# Altium schematic sheet SDCARD.SchDoc
size A4; SheetNumber: 3; SheetTotal: 6
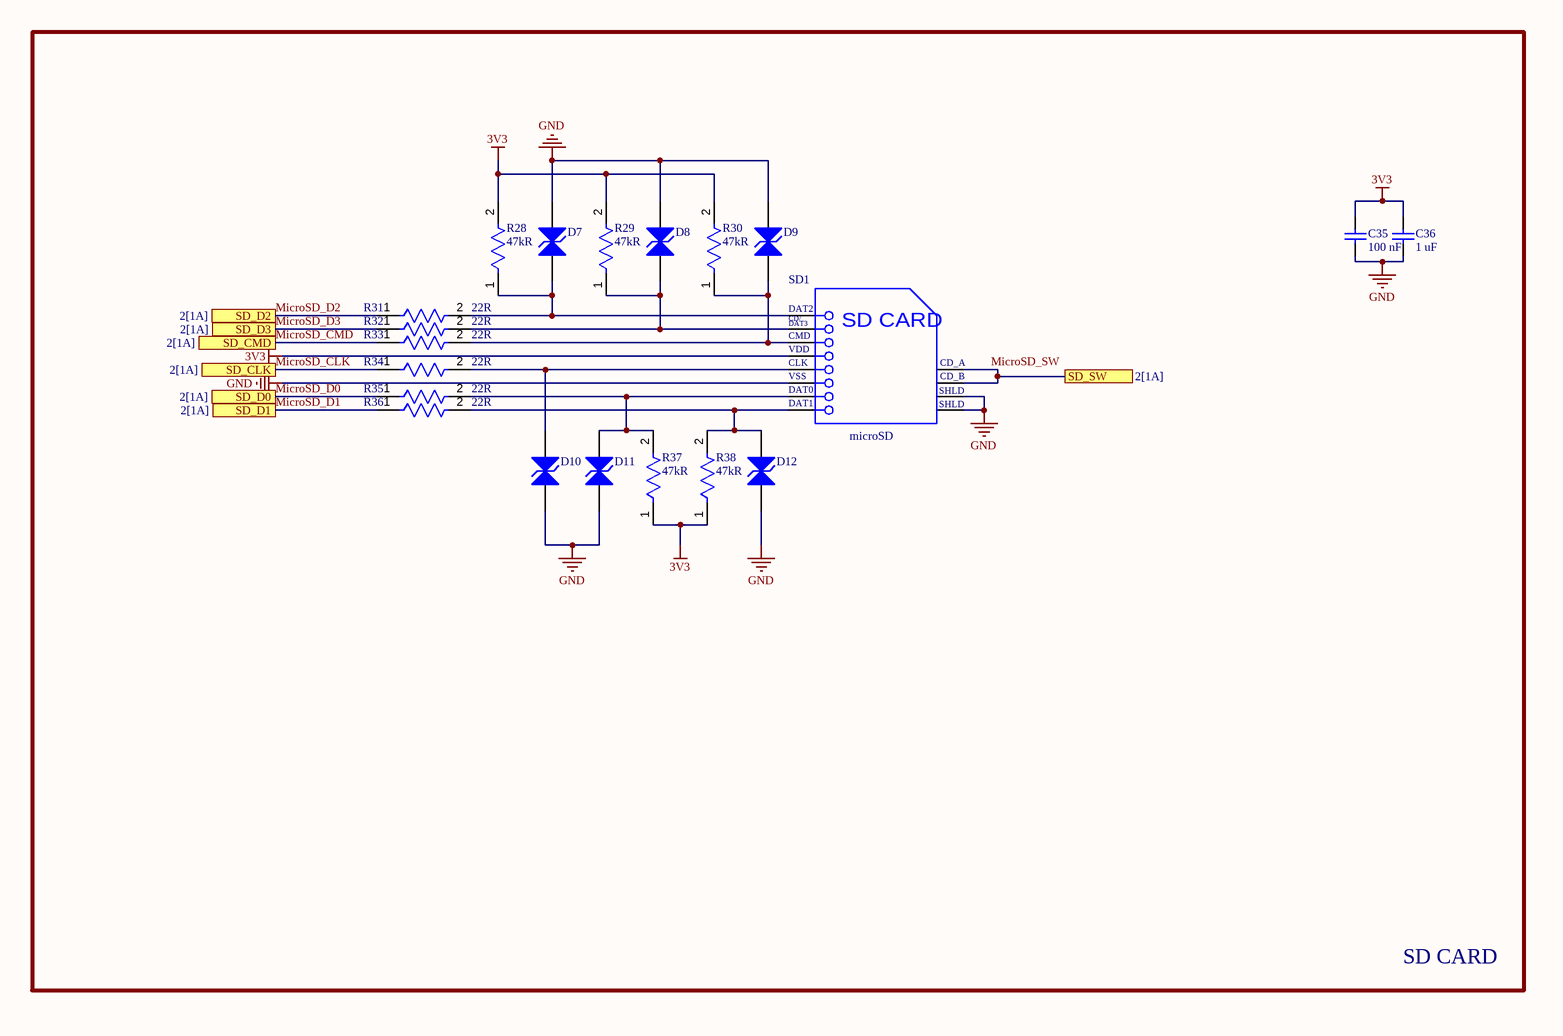
[diagram p0: SDCARD.SchDoc]

## Parts
C35  value 100 nF  [CAPC2013X145X50LL20T25]  (hidden comment: C0805C104K9RACTU)
C36  value 1 uF  [CAPC2013X135X45LL10T25]  (hidden comment: GRM21BR60J225KA01K)
D7  SMAJ5.0CA-E3/5A  [VISH-DO-214AC-2_N]  (value not drawn)
D8  SMAJ5.0CA-E3/5A  [VISH-DO-214AC-2_N]  (value not drawn)
D9  SMAJ5.0CA-E3/5A  [VISH-DO-214AC-2_N]  (value not drawn)
D10  SMAJ5.0CA-E3/5A  [VISH-DO-214AC-2_N]  (value not drawn)
D11  SMAJ5.0CA-E3/5A  [VISH-DO-214AC-2_N]  (value not drawn)
D12  SMAJ5.0CA-E3/5A  [VISH-DO-214AC-2_N]  (value not drawn)
R28  Resistance: 47kR  [FP-CRCW0805-e3-MFG]  (hidden comment: CRCW080547K0JNEA)
R29  Resistance: 47kR  [FP-CRCW0805-e3-MFG]  (hidden comment: CRCW080547K0JNEA)
R30  Resistance: 47kR  [FP-CRCW0805-e3-MFG]  (hidden comment: CRCW080547K0JNEA)
R31  Resistance: 22R  [FP-KTR10-IPC_C]  (hidden comment: KTR10EZPF22R0)
R32  Resistance: 22R  [FP-KTR10-IPC_C]  (hidden comment: KTR10EZPF22R0)
R33  Resistance: 22R  [FP-KTR10-IPC_C]  (hidden comment: KTR10EZPF22R0)
R34  Resistance: 22R  [FP-KTR10-IPC_C]  (hidden comment: KTR10EZPF22R0)
R35  Resistance: 22R  [FP-KTR10-IPC_C]  (hidden comment: KTR10EZPF22R0)
R36  Resistance: 22R  [FP-KTR10-IPC_C]  (hidden comment: KTR10EZPF22R0)
R37  Resistance: 47kR  [FP-CRCW0805-e3-MFG]  (hidden comment: CRCW080547K0JNEA)
R38  Resistance: 47kR  [FP-CRCW0805-e3-MFG]  (hidden comment: CRCW080547K0JNEA)
SD1  Card Type: microSD  [MOLX-104031-0811_V]  (hidden comment: 104031-0811)

## Ports
SD_CLK (see 2[1A]), SD_CMD (see 2[1A]), SD_D0 (see 2[1A]), SD_D1 (see 2[1A]), SD_D2 (see 2[1A]), SD_D3 (see 2[1A]), SD_SW (see 2[1A])

## Nets
3V3: C35.2 C36.2 R28.2 R29.2 R30.2 R37.1 R38.1 SD1.4(VDD)
GND: C35.1 C36.1 D7.1(A1) D8.1(A1) D9.1(A1) D10.2(A2) D11.2(A2) D12.2(A2) SD1.6(VSS2) SD1.11(SHLD1) SD1.12(SHLD2)
MicroSD_CLK: R34.1 ; port SD_CLK
MicroSD_CMD: R33.1 ; port SD_CMD
MicroSD_D0: R35.1 ; port SD_D0
MicroSD_D1: R36.1 ; port SD_D1
MicroSD_D2: R31.1 ; port SD_D2
MicroSD_D3: R32.1 ; port SD_D3
MicroSD_SW: SD1.9(CD_A) SD1.10(CD_B) ; port SD_SW
NetD7_2: D7.2(A2) R28.1 R31.2 SD1.1(CD/DAT3)
NetD8_2: D8.2(A2) R29.1 R32.2 SD1.2(CMD)
NetD9_2: D9.2(A2) R30.1 R33.2 SD1.3(VSS1)
NetD10_1: D10.1(A1) R34.2 SD1.5(CLK)
NetD11_1: D11.1(A1) R35.2 R37.2 SD1.7(DAT0)
NetD12_1: D12.1(A1) R36.2 R38.2 SD1.8(DAT1)

## Notes on the sheet
- SD CARD
- DWG. NO.
- REV.
- SHT.
- REVISION
- DESCRIPTION
- DATE
- APPROVED
- THIS DOCUMENT AND THE DATA DISCLOSED HEREIN OR HEREWITH IS THE PROPERTY OF ALTIUM LIMITED AND MAY BE FREELY DISTRIBUTED IN WHOLE. NO RIGHTS ARE RESERVED OR EXPRESS OR IMPLIED WARANTEE GIVEN.
- ENG:
- DSN:
- APPROVALS
- PROJECT
- DOCUMENT REVISION:
- DESIGN ITEM:
- CHK:
- BOM:
- REFERENCE DOCUMENTS
- PROJECT REVISION:
- TITLE
- FAB DWG:
- PCB DWG:
- ASSY DWG:
- SCALE:
- SIZE
- D
- CAGE CODE
- FILE NAME
- DWG NO.
- SHEET
- OF
- REV
- (in symbol CMP-2000-05825-1) DAT2; CD/; DAT3; SD CARD; VSS; SHLD

## Library data of the parts
C35 = CMP-1036-04391-2: Manufacturer: Kemet; Part Number: C0805C104K9RACTU
C36 = CMP-2007-03531-1: Manufacturer: Murata; Part Number: GRM21BR60J225KA01K
D7-D12 = CMP-0548-00276-2: Transient Voltage Suppressor, 6.40 to 231 V, 5 V Stand-off Voltage, Bi-Directional, -55 to 155 degC, 2-pin DO-214AC, Pb-Free, Tape and Reel; Manufacturer: Vishay Semiconductor; PPPM (W): 400, 300; VBR Bi-Directional (V): 6.4 to 231; ID (uA): 1600; IFSM: 40 A; VWM (V): 5; RoHS: TRUE; Operating Junction and Storage Temperature Range: -55 to 150 degC; Packing: Tape and Reel; ComponentLink1URL: http://www.vishay.com/; Mounting Technology: Surface Mount; ComponentLink2URL: http://www.vishay.com/docs/88390/smaj50a.pdf; PartNumber: SMAJ5.0CA-E3/5A; PackageReference: DO-214AC-2; ComponentLink1Description: Manufacturer URL; ComponentLink3Description: Package Specification; ComponentLink2Description: Datasheet; PackageDescription: 2-Pin DO-214AC (SMA), Body 4.245 x 2.665 mm; DatasheetVersion: 12/8/2013; ComponentLink3URL: http://www.vishay.com/docs/88390/smaj50a.pdf
R28-R30 R37 R38 = CMP-2001-03940-2: RES Thick Film, 47kΩ, 5%, 0.125W, 200ppm/°C, 0805; Voltage Rating: 150V; Power Rating: 125mW; Package Quantity: 5000; Radiation Hardening: No; Composition: Thick Film; Case/Package: 0805; Depth: 1.25mm; Min Operating Temperature: -55°C; Case Code (Imperial): 0805; Weight: 0.000194oz; Width: 1.25mm; Height: 0.45mm; Number of Terminations: 2; Voltage Rating (DC): 150V; Termination: SMD/SMT; Max Operating Temperature: 155°C; Case Code (Metric): 2012; Military Standard: Not; Length: 2mm; Tolerance: 5%; Packaging: Tape and Reel; Working Voltage: 150V; Lead Free: Lead Free; Temperature Coefficient: 200ppm/°C; Contact Plating: Tin
R31-R36 = CMP-08839-031728-1: Res Thick Film 0805 22Ω 1% 0.125W ±100ppm/°C Automotive Paper T/R; Max Power Dissipation: 125mW; Temperature Coefficient: 100ppm/°C; Width: 0.049inch; Length: 0.079inch; Number of Terminations: 2; Case/Package: 0805; Tolerance: 1%; Case Code (Imperial): 0805; Features: Automotive AEC-Q200; Case Code (Metric): 2012; Resistor Type: Thick Film; Min Operating Temperature: -55°C; RoHS Compliant: Yes; Height: 0.026inch; Package Quantity: 5000; Max Operating Temperature: 155°C; Series: KTR; Packaging: Cut Tape
SD1 = CMP-2000-05825-1: Micro SD Card, RA, -25 to 85 degC, 8-Pin SMD, RoHS, Tape and Reel; Voltage Rating: 10VAC/DC; Number of Contacts: 8; Insertion - Extraction Style: Push-Pull; Pitch: 1.1mm; Mating Cycles: 10000; Brand: Molex; Current Rating: 500mA; Manufacturer URL: http://www.molex.com/; Mounting Type: Standard; Height: 1.42mm; Mounting Technology: SurfaceMount; Contact Plating: Gold; Product Category: MemoryCardConnectors; Package Description: 8-Pin Surface Mount Device, Body 11.95 x 11.4 mm, Pitch 1.1 mm; Datasheet URL: http://www.molex.com/pdm_docs/sd/1040310811_sd.pdf; Termination Style: SMD; Length: 11.4mm; Housing Material: LiquidCrystalPolymer(LCP); Orientation: RightAngle; RoHS: True; Contact Material: PhosphorBronze; Datasheet Version: Rev. E, 04/2006; Packaging: Reel; Manufacturer: Molex; Series: 104031; Product: CardConnectors; Number of Rows: 1Row; Package Reference: 104031-0811